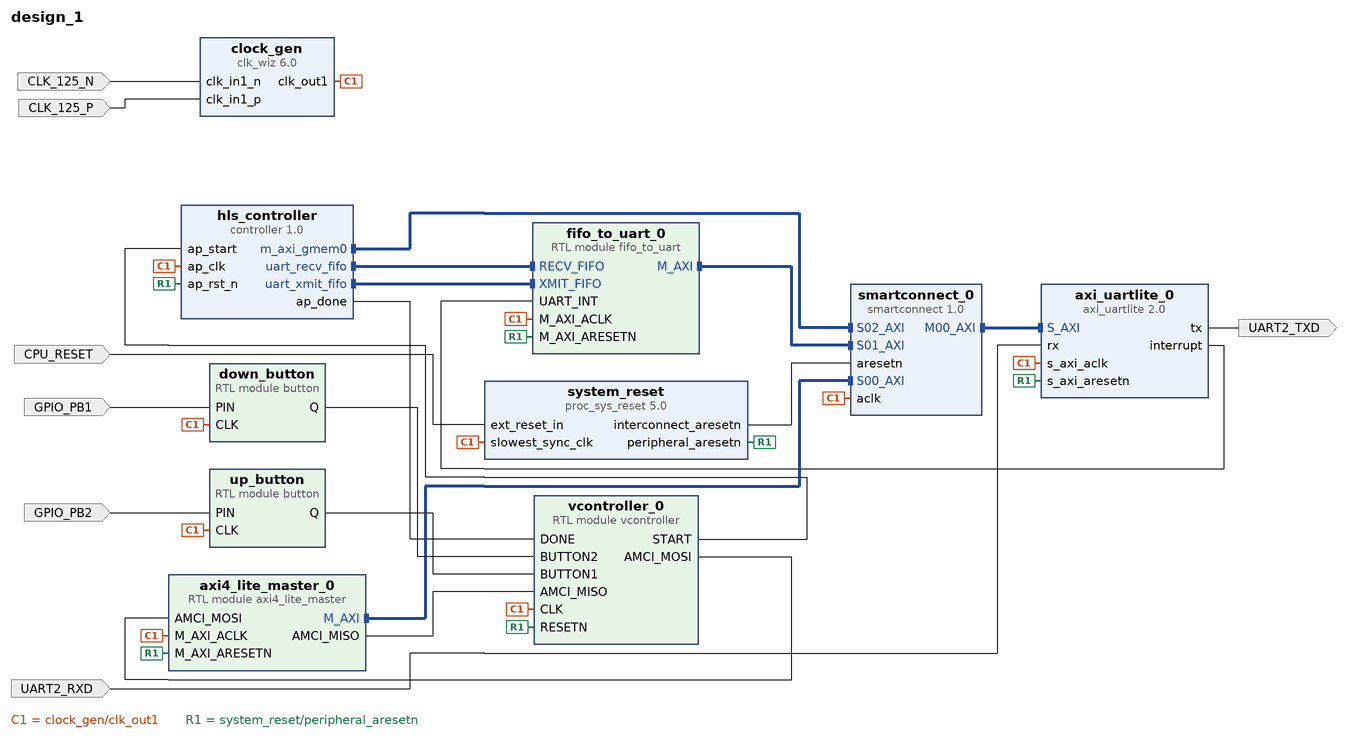
[diagram p0: block diagram of the top level]
# Vivado block design design_1, xczu7ev-ffvc1156-2-e, Vivado 2021.2
create_bd_design design_1

create_bd_port -dir I -type clk CLK_125_N
create_bd_port -dir I -type clk CLK_125_P
set_property -dict {CONFIG.ASSOCIATED_RESET CPU_RESET} [get_bd_ports CLK_125_P]
create_bd_port -dir I GPIO_PB1
create_bd_port -dir I GPIO_PB2
create_bd_port -dir I -type rst CPU_RESET
set_property -dict {CONFIG.POLARITY ACTIVE_HIGH} [get_bd_ports CPU_RESET]
create_bd_port -dir I UART2_RXD
create_bd_port -dir O UART2_TXD

create_bd_cell -type module -reference button up_button
create_bd_cell -type module -reference button down_button
create_bd_cell -type ip -vlnv xilinx.com:ip:clk_wiz:6.0 clock_gen
set_property -dict [list \
  CONFIG.CLKIN1_JITTER_PS 80.0 \
  CONFIG.CLKOUT1_DRIVES BUFGCE \
  CONFIG.CLKOUT1_JITTER 107.164 \
  CONFIG.CLKOUT1_PHASE_ERROR 85.285 \
  CONFIG.CLKOUT1_REQUESTED_OUT_FREQ 125 \
  CONFIG.CLKOUT2_DRIVES BUFGCE \
  CONFIG.CLKOUT3_DRIVES BUFGCE \
  CONFIG.CLKOUT4_DRIVES BUFGCE \
  CONFIG.CLKOUT5_DRIVES BUFGCE \
  CONFIG.CLKOUT6_DRIVES BUFGCE \
  CONFIG.CLKOUT7_DRIVES BUFGCE \
  CONFIG.FEEDBACK_SOURCE FDBK_AUTO \
  CONFIG.MMCM_CLKFBOUT_MULT_F 9.625 \
  CONFIG.MMCM_CLKIN1_PERIOD 8.000 \
  CONFIG.MMCM_CLKOUT0_DIVIDE_F 9.625 \
  CONFIG.MMCM_DIVCLK_DIVIDE 1 \
  CONFIG.PRIM_IN_FREQ 125 \
  CONFIG.PRIM_SOURCE Differential_clock_capable_pin \
  CONFIG.RESET_BOARD_INTERFACE Custom \
  CONFIG.USE_BOARD_FLOW true \
  CONFIG.USE_LOCKED false \
  CONFIG.USE_RESET false \
  CONFIG.USE_SAFE_CLOCK_STARTUP true \
] [get_bd_cells clock_gen]
create_bd_cell -type module -reference axi4_lite_master axi4_lite_master_0
create_bd_cell -type ip -vlnv xilinx.com:ip:axi_uartlite:2.0 axi_uartlite_0
set_property -dict [list \
  CONFIG.C_BAUDRATE 115200 \
  CONFIG.UARTLITE_BOARD_INTERFACE Custom \
  CONFIG.USE_BOARD_FLOW true \
] [get_bd_cells axi_uartlite_0]
create_bd_cell -type ip -vlnv xilinx.com:ip:proc_sys_reset:5.0 system_reset
create_bd_cell -type ip -vlnv xilinx.com:ip:smartconnect:1.0 smartconnect_0
set_property -dict {CONFIG.NUM_SI 3} [get_bd_cells smartconnect_0]
create_bd_cell -type module -reference fifo_to_uart fifo_to_uart_0
create_bd_cell -type module -reference vcontroller vcontroller_0
create_bd_cell -type ip -vlnv xilinx.com:hls:controller:1.0 hls_controller

# ---- connections ----

connect_bd_intf_net [get_bd_intf_pins smartconnect_0/S00_AXI] [get_bd_intf_pins axi4_lite_master_0/M_AXI]
connect_bd_intf_net -intf_net controller_0_m_axi_gmem0 [get_bd_intf_pins hls_controller/m_axi_gmem0] [get_bd_intf_pins smartconnect_0/S02_AXI]
connect_bd_intf_net -intf_net controller_0_uart_recv_fifo [get_bd_intf_pins hls_controller/uart_recv_fifo] [get_bd_intf_pins fifo_to_uart_0/RECV_FIFO]
connect_bd_intf_net -intf_net controller_0_uart_xmit_fifo [get_bd_intf_pins fifo_to_uart_0/XMIT_FIFO] [get_bd_intf_pins hls_controller/uart_xmit_fifo]
connect_bd_intf_net [get_bd_intf_pins smartconnect_0/S01_AXI] [get_bd_intf_pins fifo_to_uart_0/M_AXI]
connect_bd_intf_net [get_bd_intf_pins smartconnect_0/M00_AXI] [get_bd_intf_pins axi_uartlite_0/S_AXI]
connect_bd_net [get_bd_ports CPU_RESET] [get_bd_pins system_reset/ext_reset_in]
connect_bd_net -net PIN_0_1 [get_bd_ports GPIO_PB1] [get_bd_pins down_button/PIN]
connect_bd_net -net PIN_1_1 [get_bd_ports GPIO_PB2] [get_bd_pins up_button/PIN]
connect_bd_net [get_bd_pins axi4_lite_master_0/AMCI_MISO] [get_bd_pins vcontroller_0/AMCI_MISO]
connect_bd_net [get_bd_pins axi_uartlite_0/interrupt] [get_bd_pins fifo_to_uart_0/UART_INT]
connect_bd_net [get_bd_pins axi_uartlite_0/tx] [get_bd_ports UART2_TXD]
connect_bd_net -net clk_in1_n_0_1 [get_bd_ports CLK_125_N] [get_bd_pins clock_gen/clk_in1_n]
connect_bd_net -net clk_in1_p_0_1 [get_bd_ports CLK_125_P] [get_bd_pins clock_gen/clk_in1_p]
connect_bd_net -net clk_wiz_clk_out1 [get_bd_pins clock_gen/clk_out1] \
  [get_bd_pins down_button/CLK] [get_bd_pins up_button/CLK] [get_bd_pins axi4_lite_master_0/M_AXI_ACLK] \
  [get_bd_pins system_reset/slowest_sync_clk] [get_bd_pins axi_uartlite_0/s_axi_aclk] [get_bd_pins smartconnect_0/aclk] \
  [get_bd_pins fifo_to_uart_0/M_AXI_ACLK] [get_bd_pins vcontroller_0/CLK] [get_bd_pins hls_controller/ap_clk]
connect_bd_net -net controller_0_ap_done [get_bd_pins hls_controller/ap_done] [get_bd_pins vcontroller_0/DONE]
connect_bd_net [get_bd_pins down_button/Q] [get_bd_pins vcontroller_0/BUTTON2]
connect_bd_net -net rst_clk_wiz_125M_peripheral_aresetn [get_bd_pins system_reset/peripheral_aresetn] \
  [get_bd_pins axi4_lite_master_0/M_AXI_ARESETN] [get_bd_pins axi_uartlite_0/s_axi_aresetn] \
  [get_bd_pins fifo_to_uart_0/M_AXI_ARESETN] [get_bd_pins vcontroller_0/RESETN] [get_bd_pins hls_controller/ap_rst_n]
connect_bd_net -net rx_0_1 [get_bd_ports UART2_RXD] [get_bd_pins axi_uartlite_0/rx]
connect_bd_net [get_bd_pins system_reset/interconnect_aresetn] [get_bd_pins smartconnect_0/aresetn]
connect_bd_net [get_bd_pins up_button/Q] [get_bd_pins vcontroller_0/BUTTON1]
connect_bd_net [get_bd_pins vcontroller_0/AMCI_MOSI] [get_bd_pins axi4_lite_master_0/AMCI_MOSI]
connect_bd_net [get_bd_pins vcontroller_0/START] [get_bd_pins hls_controller/ap_start]

# ---- address map ----
assign_bd_address -offset 0x40600000 -range 64K -target_address_space [get_bd_addr_spaces axi4_lite_master_0/M_AXI] [get_bd_addr_segs axi_uartlite_0/S_AXI/Reg]
assign_bd_address -offset 0x40600000 -range 64K -target_address_space [get_bd_addr_spaces fifo_to_uart_0/M_AXI] [get_bd_addr_segs axi_uartlite_0/S_AXI/Reg]

validate_bd_design
save_bd_design
